# Altium schematic sheet pmu.SchDoc
size A; SheetNumber: 1; SheetTotal: 1; SPICEModelCacheIUZUPHTK: <root> / <DocumentId>IUZUPHTK</DocumentId> / </root>
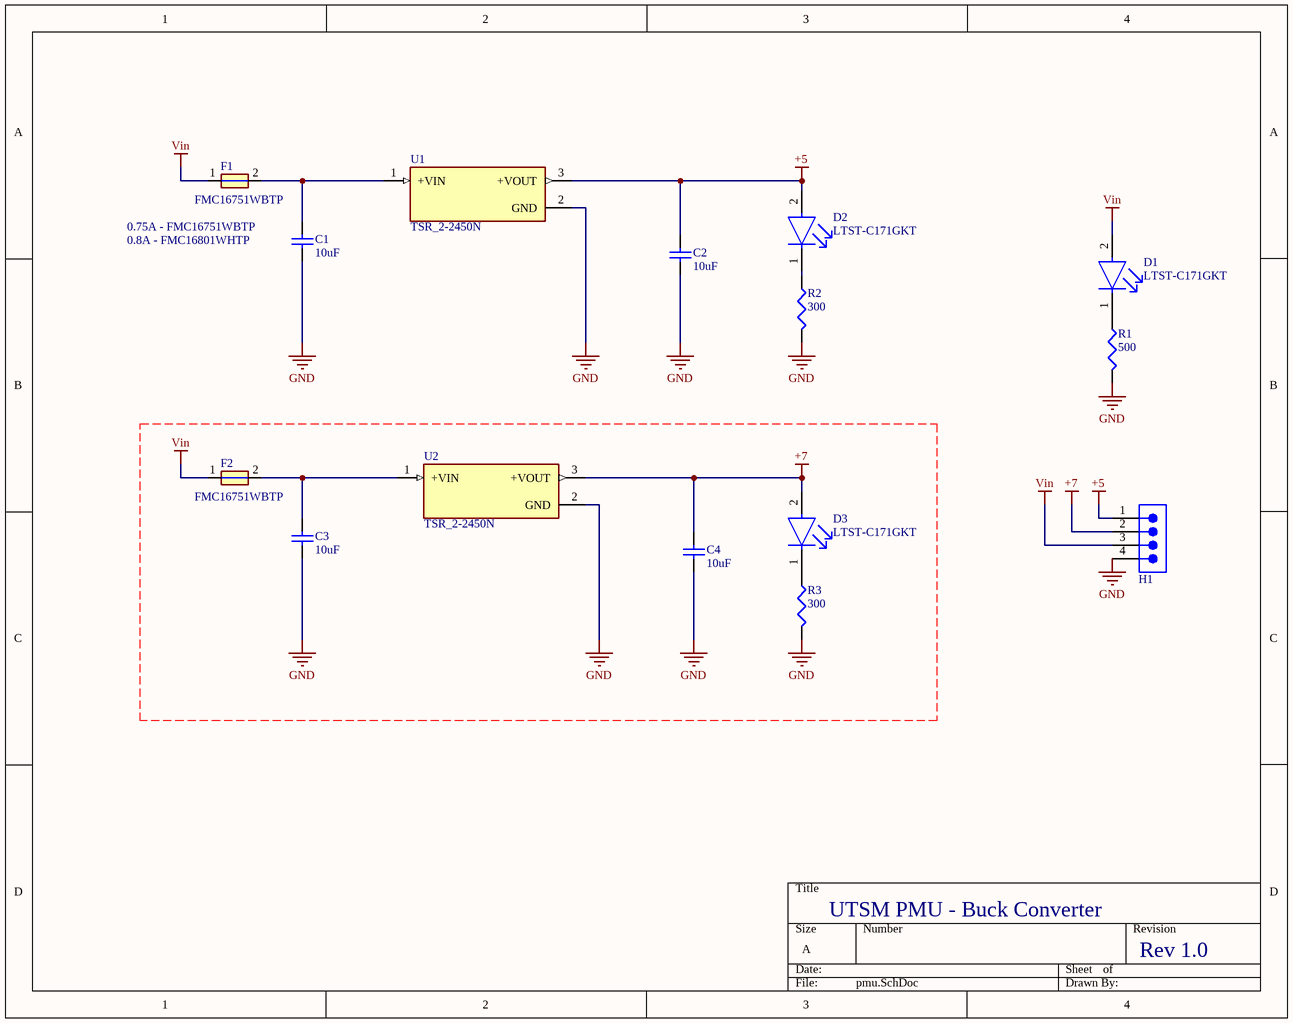
[diagram p0: pmu.SchDoc]

## Parts
C1  value 10uF  [0603c]  (hidden comment: Cap)
C2  value 10uF  [0603c]  (hidden comment: Cap)
C3  value 10uF  [0603c]  (hidden comment: Cap)
C4  value 10uF  [0603c]  (hidden comment: Cap)
D1  LTST-C171GKT  [FP-LTST-C171GKT-MFG]
D2  LTST-C171GKT  [FP-LTST-C171GKT-MFG]
D3  LTST-C171GKT  [FP-LTST-C171GKT-MFG]
F1  FMC16751WBTP  [FUSC1608X64N]
F2  FMC16751WBTP  [FUSC1608X64N]
H1  61300411121  [61300411121]  (value not drawn)
R1  value 500  [0603r]
R2  value 300  [0603r]
R3  value 300  [0603r]
U1  TSR_2-2450N  [CONV_TSR_2-2450N]
U2  TSR_2-2450N  [CONV_TSR_2-2450N]

## Nets
+5: C2.2 D2.2(A) H1.1 U1.3(+VOUT)
+7: C4.2 D3.2(A) H1.2 U2.3(+VOUT)
GND: C1.1 C2.1 C3.1 C4.1 H1.4 R1.2 R2.2 R3.2 U1.2(GND) U2.2(GND)
Vin: D1.2(A) F1.1 F2.1 H1.3
NetC1_2: C1.2 F1.2 U1.1(+VIN)
NetC3_2: C3.2 F2.2 U2.1(+VIN)
NetD1_1: D1.1(C) R1.1
NetD2_1: D2.1(C) R2.1
NetD3_1: D3.1(C) R3.1

## Notes on the sheet
- 0.75A - FMC16751WBTP
- 0.8A - FMC16801WHTP
- UTSM PMU - Buck Converter
- Rev 1.0

## Library data of the parts
C1 C3 = Cap: SMD Capacitor / CL21A106KOQNNNG; Published: 8-Jun-2000; LatestRevisionDate: 17-Jul-2002; LatestRevisionNote: Re-released for DXP Platform.; PackageReference: RAD-0.3; Publisher: Altium Limited; PackageDescription: Radial Cap, Thru-Hole; 2 Leads; 0.3 in Pin Spacing
C2 C4 = Cap: SMD Capacitor; Published: 8-Jun-2000; LatestRevisionDate: 17-Jul-2002; LatestRevisionNote: Re-released for DXP Platform.; PackageReference: RAD-0.3; Publisher: Altium Limited; PackageDescription: Radial Cap, Thru-Hole; 2 Leads; 0.3 in Pin Spacing
D1-D3 = CMP-22017-000007-1: LED GREEN CLEAR CHIP SMD; Luminous Intensity: 12mcd; Lens Color: Colorless; Dominant Wavelength: 569nm; Number of LEDs: 1; Power Dissipation: 100mW; Viewing Angle: 130°; Reverse Voltage: 5V; Test Current: 10mA; Forward Voltage: 2.1V; Wavelength: 585nm; Lens Style: Diffused; Forward Current: 30mA; Height: 0.8mm; Mount: Surface Mount; Package Quantity: 1; Length: 2mm; Case Code (Metric): 2012; Number of Pins: 2; Number of Elements: 1; Packaging: Tape and Reel; Color: Green; Min Operating Temperature: -55°C; Case/Package: 0805; Power Rating: 100mW; Max Operating Temperature: 85°C; Radiation Hardening: No; Depth: 1.25mm; Lens Transparency: Clear; Width: 1.25mm; Lead Free: Lead Free; Case Code (Imperial): 0805; Illumination Color: Green
F1 F2 = ERB-RE1R00V: 0.8A - FMC16801WHTP / 0.75A - FMC16751WBTP; MF: Panasonic; Package: 0603 Panasonic Electronic Components; MP: ERB-RE1R00V; Check_prices: https://www.snapeda.com/parts/ERB-RE1R00V/Panasonic/view-part/?ref=eda; Purchase-URL: https://pricing.snapeda.com/search/part/ERB-RE1R00V/?ref=eda; Value: *; Availability: In Stock; Price: None; SnapEDA_Link: https://www.snapeda.com/parts/ERB-RE1R00V/Panasonic/view-part/?ref=snap
H1 = 61300411121: WR-PHD Pin Header, THT, Vertical, pitch 2.54mm, 1 Row, 4P; Manufacturer: Wurth Elektronik; Contact Resistance: 20mOhm; Rated Current: 3A; Working Voltage: 250V; Withstanding Voltage: 500V; Manufacturer Part Number: 61300411121; Category: Board-to-Board Connectors; Match Code: WR-PHD; ComponentLink1Description: Website Link; ComponentLink1URL: https://www.we-online.com/redexpert/article/61300411121?ad; ComponentLink2Description: Datasheet Link; ComponentLink2URL: https://www.we-online.com/redexpert/spec/61300411121?ad; Mount: Through Hole; Operating Temperature Max: 105°C; Operating Temperature Min: -40°C; Packaging: Bag; Gender: Pin Header; Number of Pins: 4; Number of Rows: 1; Orientation: Vertical; Pitch: 2.54mm
R1-R3 = Res3: SMD Resistor; Published: 8-Jun-2000; LatestRevisionDate: 29-May-2009; LatestRevisionNote: IPC-7351 Footprint Added.; PackageReference: J1-0603; Publisher: Altium Limited; PackageDescription: Chip Resistor
U1 U2 = TSR_2-2450N: MF: {'manufacturer': u'Traco Power'}; Package: None; Price: None; Value: *; MP: TSR_2-2450N; Availability: Unavailable